# Vivado block design design_1, xczu28dr-ffvg1517-2-e, Vivado 2019.1
# (continued, part 2 of 3)
current_bd_instance /tx_datapath/macro_channel_1/soft_reset

# ---- hierarchy /tx_datapath/macro_channel_2 ----
current_bd_instance /tx_datapath/macro_channel_2
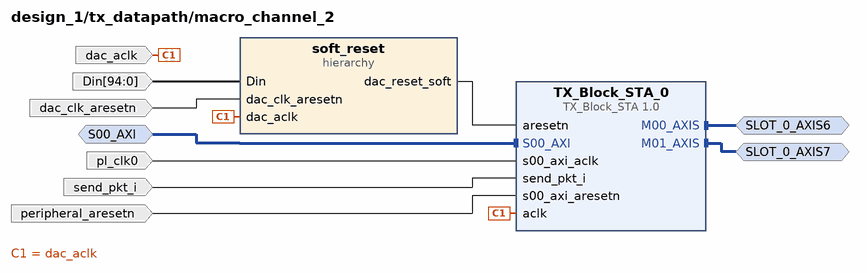
[diagram p19: block diagram inside /tx_datapath/macro_channel_2]
create_bd_intf_pin -mode Master -vlnv xilinx.com:interface:axis_rtl:1.0 SLOT_0_AXIS7
create_bd_intf_pin -mode Master -vlnv xilinx.com:interface:axis_rtl:1.0 SLOT_0_AXIS6
create_bd_intf_pin -mode Slave -vlnv xilinx.com:interface:aximm_rtl:1.0 S00_AXI
create_bd_pin -dir I -from 94 -to 0 Din
create_bd_pin -dir I send_pkt_i
create_bd_pin -dir I -type clk pl_clk0
create_bd_pin -dir I -type rst peripheral_aresetn
create_bd_pin -dir I -type clk dac_clk_aresetn
create_bd_pin -dir I -type clk dac_aclk

create_bd_cell -type hier soft_reset
create_bd_cell -type ip -vlnv user.org:user:TX_Block_STA:1.0 TX_Block_STA_0
set_property -dict {CONFIG.STREAM 2} [get_bd_cells TX_Block_STA_0]

# ---- hierarchy /tx_datapath/macro_channel_2/soft_reset ----
current_bd_instance /tx_datapath/macro_channel_2/soft_reset
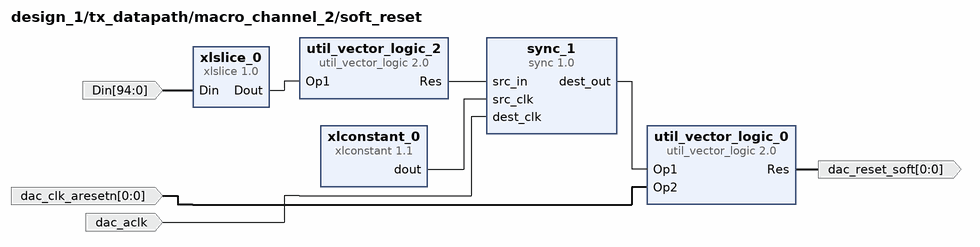
[diagram p20: block diagram inside /tx_datapath/macro_channel_2/soft_reset]
create_bd_pin -dir I -from 0 -to 0 dac_clk_aresetn
create_bd_pin -dir O -from 0 -to 0 dac_reset_soft
create_bd_pin -dir I -type clk dac_aclk
create_bd_pin -dir I -from 94 -to 0 Din

create_bd_cell -type ip -vlnv xilinx.com:ip:xlslice:1.0 xlslice_0
set_property -dict {CONFIG.DIN_FROM 2 CONFIG.DIN_TO 2 CONFIG.DIN_WIDTH 95 CONFIG.DOUT_WIDTH 1} [get_bd_cells xlslice_0]
create_bd_cell -type ip -vlnv xilinx.com:ip:util_vector_logic:2.0 util_vector_logic_0
set_property -dict {CONFIG.C_SIZE 1} [get_bd_cells util_vector_logic_0]
create_bd_cell -type ip -vlnv xilinx.com:ip:util_vector_logic:2.0 util_vector_logic_2
set_property -dict {CONFIG.C_OPERATION not CONFIG.C_SIZE 1} [get_bd_cells util_vector_logic_2]
create_bd_cell -type ip -vlnv xilinx.com:user:sync:1.0 sync_1
set_property -dict {CONFIG.SRC_INPUT_REG 0} [get_bd_cells sync_1]
create_bd_cell -type ip -vlnv xilinx.com:ip:xlconstant:1.1 xlconstant_0
set_property -dict {CONFIG.CONST_VAL 0} [get_bd_cells xlconstant_0]

# ---- hierarchy /tx_datapath/macro_channel_3 ----
current_bd_instance /tx_datapath/macro_channel_3
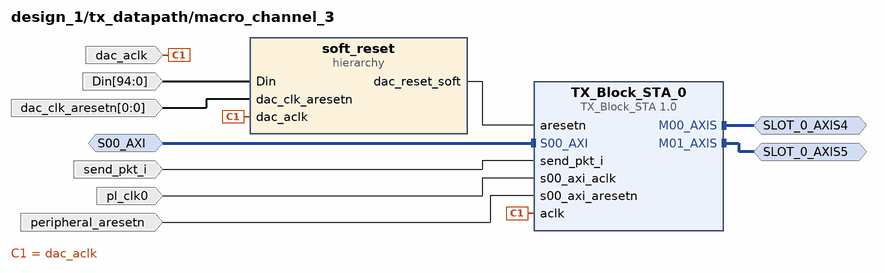
[diagram p21: block diagram inside /tx_datapath/macro_channel_3]
create_bd_intf_pin -mode Master -vlnv xilinx.com:interface:axis_rtl:1.0 SLOT_0_AXIS4
create_bd_intf_pin -mode Master -vlnv xilinx.com:interface:axis_rtl:1.0 SLOT_0_AXIS5
create_bd_intf_pin -mode Slave -vlnv xilinx.com:interface:aximm_rtl:1.0 S00_AXI
create_bd_pin -dir I -from 94 -to 0 Din
create_bd_pin -dir I send_pkt_i
create_bd_pin -dir I -type clk pl_clk0
create_bd_pin -dir I -type rst peripheral_aresetn
create_bd_pin -dir I -type clk dac_aclk
create_bd_pin -dir I -from 0 -to 0 dac_clk_aresetn

create_bd_cell -type hier soft_reset
create_bd_cell -type ip -vlnv user.org:user:TX_Block_STA:1.0 TX_Block_STA_0
set_property -dict {CONFIG.STREAM 3} [get_bd_cells TX_Block_STA_0]

# ---- hierarchy /tx_datapath/macro_channel_3/soft_reset ----
current_bd_instance /tx_datapath/macro_channel_3/soft_reset
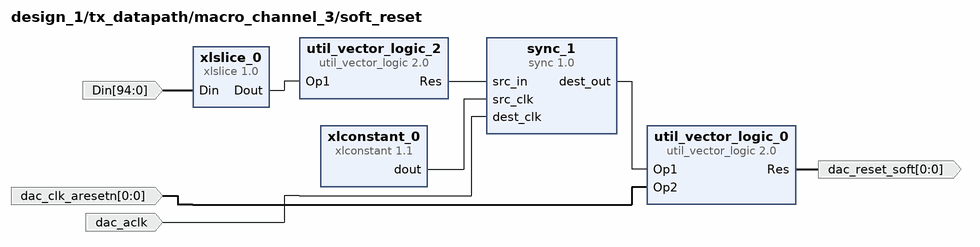
[diagram p22: block diagram inside /tx_datapath/macro_channel_3/soft_reset]
create_bd_pin -dir I -from 0 -to 0 dac_clk_aresetn
create_bd_pin -dir O -from 0 -to 0 dac_reset_soft
create_bd_pin -dir I -type clk dac_aclk
create_bd_pin -dir I -from 94 -to 0 Din

create_bd_cell -type ip -vlnv xilinx.com:ip:xlslice:1.0 xlslice_0
set_property -dict {CONFIG.DIN_FROM 3 CONFIG.DIN_TO 3 CONFIG.DIN_WIDTH 95 CONFIG.DOUT_WIDTH 1} [get_bd_cells xlslice_0]
create_bd_cell -type ip -vlnv xilinx.com:ip:util_vector_logic:2.0 util_vector_logic_0
set_property -dict {CONFIG.C_SIZE 1} [get_bd_cells util_vector_logic_0]
create_bd_cell -type ip -vlnv xilinx.com:ip:util_vector_logic:2.0 util_vector_logic_2
set_property -dict {CONFIG.C_OPERATION not CONFIG.C_SIZE 1} [get_bd_cells util_vector_logic_2]
create_bd_cell -type ip -vlnv xilinx.com:user:sync:1.0 sync_1
set_property -dict {CONFIG.SRC_INPUT_REG 0} [get_bd_cells sync_1]
create_bd_cell -type ip -vlnv xilinx.com:ip:xlconstant:1.1 xlconstant_0
set_property -dict {CONFIG.CONST_VAL 0} [get_bd_cells xlconstant_0]

# ---- connections ----

current_bd_instance /MTS_Block
connect_bd_intf_net [get_bd_intf_pins CLK_DIFF_SYSREF_CLK] [get_bd_intf_pins util_ds_buf_1/CLK_IN_D]
connect_bd_intf_net [get_bd_intf_pins CLK_DIFF_PL_CLK] [get_bd_intf_pins util_ds_buf_0/CLK_IN_D]
connect_bd_net [get_bd_pins util_ds_buf_0/IBUF_OUT] [get_bd_pins clk_wiz_0/clk_in1] [get_bd_pins sync_0/dest_clk]
connect_bd_net [get_bd_pins sync_0/dest_out] [get_bd_pins sync_1/src_in] [get_bd_pins sync_2/src_in]
connect_bd_net [get_bd_pins sync_1/dest_out] [get_bd_pins user_sysref_dac]
connect_bd_net [get_bd_pins xlconstant_0/dout] [get_bd_pins sync_0/src_clk] [get_bd_pins sync_1/src_clk] [get_bd_pins sync_2/src_clk]
connect_bd_net [get_bd_pins util_ds_buf_1/IBUF_OUT] [get_bd_pins sync_0/src_in]
connect_bd_net [get_bd_pins sync_2/dest_out] [get_bd_pins user_sysref_adc]
connect_bd_net [get_bd_pins clk_wiz_0/clk_out3] [get_bd_pins adc45_clk] [get_bd_pins sync_2/dest_clk]
connect_bd_net [get_bd_pins clk_wiz_0/clk_out1] [get_bd_pins dac45_clk] [get_bd_pins sync_1/dest_clk]
connect_bd_net [get_bd_pins clk_wiz_0/clk_out2] [get_bd_pins dac_clk]
connect_bd_net [get_bd_pins clk_wiz_0/clk_out4] [get_bd_pins adc_clk]

current_bd_instance /reset_block
connect_bd_net -net zynq_ultra_ps_e_0_pl_clk0 [get_bd_pins slowest_sync_clk] [get_bd_pins rst_ps8_0_96M/slowest_sync_clk]
connect_bd_net -net zynq_ultra_ps_e_0_pl_resetn0 [get_bd_pins ext_reset_in] \
  [get_bd_pins rst_ps8_0_96M1/ext_reset_in] [get_bd_pins rst_ps8_0_96M/ext_reset_in] \
  [get_bd_pins rst_ps8_0_96M2/ext_reset_in]
connect_bd_net [get_bd_pins rst_ps8_0_96M/peripheral_aresetn] [get_bd_pins peripheral_aresetn]
connect_bd_net -net MTS_Block_dac_clk [get_bd_pins slowest_sync_clk1] [get_bd_pins rst_ps8_0_96M1/slowest_sync_clk]
connect_bd_net [get_bd_pins rst_ps8_0_96M1/peripheral_aresetn] [get_bd_pins peripheral_aresetn1]
connect_bd_net [get_bd_pins rst_ps8_0_96M2/peripheral_aresetn] [get_bd_pins peripheral_aresetn3]
connect_bd_net -net slowest_sync_clk3_1 [get_bd_pins slowest_sync_clk3] [get_bd_pins rst_ps8_0_96M2/slowest_sync_clk]

current_bd_instance /control_block
connect_bd_net -net Din_0_1 [get_bd_pins Din_0] [get_bd_pins globalstart_gpio_adc/Din] [get_bd_pins globalstart_gpio_dac/Din]
connect_bd_net [get_bd_pins xlconstant_0/dout] [get_bd_pins sync_1/src_clk] [get_bd_pins sync_2/src_clk]
connect_bd_net [get_bd_pins sync_1/dest_out] [get_bd_pins adc_control]
connect_bd_net -net dest_clk_1 [get_bd_pins adc_clk] [get_bd_pins sync_1/dest_clk]
connect_bd_net [get_bd_pins globalstart_gpio_adc/Dout] [get_bd_pins sync_1/src_in]
connect_bd_net [get_bd_pins globalstart_gpio_dac/Dout] [get_bd_pins sync_2/src_in]
connect_bd_net [get_bd_pins dest_clk] [get_bd_pins sync_2/dest_clk]
connect_bd_net [get_bd_pins sync_2/dest_out] [get_bd_pins dac_control]

current_bd_instance /SPB_blocks
connect_bd_intf_net -intf_net S01_AXIS1_1 [get_bd_intf_pins S01_AXIS1] [get_bd_intf_pins stream_0/S01_AXIS1]
connect_bd_intf_net [get_bd_intf_pins S00_AXI7] [get_bd_intf_pins stream_3/S00_AXI1]
connect_bd_intf_net [get_bd_intf_pins S00_AXI10] [get_bd_intf_pins stream_2/S00_AXI1]
connect_bd_intf_net [get_bd_intf_pins S00_AXI1] [get_bd_intf_pins stream_0/S00_AXI1]
connect_bd_intf_net [get_bd_intf_pins S01_AXI] [get_bd_intf_pins stream_0/S01_AXI]
connect_bd_intf_net [get_bd_intf_pins S00_AXI9] [get_bd_intf_pins stream_1/S00_AXI1]
connect_bd_intf_net [get_bd_intf_pins S01_AXI2] [get_bd_intf_pins stream_1/S01_AXI]
connect_bd_intf_net [get_bd_intf_pins S00_AXI4] [get_bd_intf_pins stream_3/S00_AXI2]
connect_bd_intf_net [get_bd_intf_pins S06_AXIS] [get_bd_intf_pins stream_3/S06_AXIS]
connect_bd_intf_net [get_bd_intf_pins S04_AXIS] [get_bd_intf_pins stream_2/S04_AXIS]
connect_bd_intf_net [get_bd_intf_pins S02_AXIS] [get_bd_intf_pins stream_1/S02_AXIS]
connect_bd_intf_net [get_bd_intf_pins S05_AXIS] [get_bd_intf_pins stream_2/S05_AXIS]
connect_bd_intf_net [get_bd_intf_pins S03_AXIS] [get_bd_intf_pins stream_1/S03_AXIS]
connect_bd_intf_net [get_bd_intf_pins S01_AXI1] [get_bd_intf_pins stream_3/S01_AXI]
connect_bd_intf_net [get_bd_intf_pins S00_AXI17] [get_bd_intf_pins stream_0/S00_AXI]
connect_bd_intf_net -intf_net S00_AXI2_1 [get_bd_intf_pins S00_AXI2] [get_bd_intf_pins stream_0/S00_AXI2]
connect_bd_intf_net [get_bd_intf_pins S00_AXI3] [get_bd_intf_pins stream_1/S00_AXI]
connect_bd_intf_net [get_bd_intf_pins S07_AXIS] [get_bd_intf_pins stream_3/S07_AXIS]
connect_bd_intf_net [get_bd_intf_pins S00_AXI6] [get_bd_intf_pins stream_2/S00_AXI]
connect_bd_intf_net [get_bd_intf_pins S00_AXI] [get_bd_intf_pins stream_0/S00_AXI3]
connect_bd_intf_net [get_bd_intf_pins S00_AXIS] [get_bd_intf_pins stream_0/S00_AXIS]
connect_bd_intf_net [get_bd_intf_pins S01_AXI4] [get_bd_intf_pins stream_2/S01_AXI]
connect_bd_net [get_bd_pins aclk] \
  [get_bd_pins stream_0/aclk] [get_bd_pins stream_1/aclk] [get_bd_pins stream_2/aclk] [get_bd_pins stream_3/aclk] \
  [get_bd_pins soft_reset/dac_aclk]
connect_bd_net [get_bd_pins s00_axi_aclk] \
  [get_bd_pins stream_0/s00_axi_aclk] [get_bd_pins stream_1/s00_axi_aclk] [get_bd_pins stream_2/s00_axi_aclk] \
  [get_bd_pins stream_3/s00_axi_aclk]
connect_bd_net [get_bd_pins s00_axi_aresetn] \
  [get_bd_pins stream_0/s00_axi_aresetn] [get_bd_pins stream_1/s00_axi_aresetn] [get_bd_pins stream_2/s00_axi_aresetn] \
  [get_bd_pins stream_3/s00_axi_aresetn]
connect_bd_net [get_bd_pins adc_220_aclk] \
  [get_bd_pins stream_0/adc_220_aclk] [get_bd_pins stream_1/adc_220_aclk] [get_bd_pins stream_2/adc_220_aclk] \
  [get_bd_pins stream_3/adc_220_aclk]
connect_bd_net [get_bd_pins adc_220_aresetn] \
  [get_bd_pins stream_0/adc_220_aresetn] [get_bd_pins stream_1/adc_220_aresetn] [get_bd_pins stream_2/adc_220_aresetn] \
  [get_bd_pins stream_3/adc_220_aresetn]
connect_bd_net [get_bd_pins stream_3/PD_FLAG1] [get_bd_pins PD_and_BD_block/Op8]
connect_bd_net [get_bd_pins stream_2/PD_FLAG] [get_bd_pins PD_and_BD_block/Op6]
connect_bd_net [get_bd_pins soft_reset/dac_reset_soft] \
  [get_bd_pins stream_0/adc_clk_soft_aresetn] [get_bd_pins stream_1/adc_clk_soft_aresetn] \
  [get_bd_pins stream_2/adc_clk_soft_aresetn] [get_bd_pins stream_3/adc_clk_soft_aresetn]
connect_bd_net [get_bd_pins adc_clk_soft_aresetn] [get_bd_pins soft_reset/dac_clk_aresetn]
connect_bd_net [get_bd_pins Din] [get_bd_pins soft_reset/Din]
connect_bd_net [get_bd_pins stream_0/PD_FLAG] [get_bd_pins PD_and_BD_block/Op1]
connect_bd_net [get_bd_pins stream_0/BD_FLAG_O] [get_bd_pins PD_and_BD_block/Op2]
connect_bd_net [get_bd_pins stream_1/PD_FLAG] [get_bd_pins PD_and_BD_block/Op3]
connect_bd_net [get_bd_pins stream_1/BD_FLAG_O] [get_bd_pins PD_and_BD_block/Op4]
connect_bd_net [get_bd_pins stream_2/BD_FLAG_O] [get_bd_pins PD_and_BD_block/Op5]
connect_bd_net [get_bd_pins stream_3/BD_FLAG_O] [get_bd_pins PD_and_BD_block/Op7]
connect_bd_net [get_bd_pins PD_and_BD_block/Res] \
  [get_bd_pins stream_1/PD_FLAG1] [get_bd_pins stream_2/PD_FLAG1] [get_bd_pins stream_3/PD_FLAG] \
  [get_bd_pins stream_0/PD_FLAG1]
connect_bd_net [get_bd_pins PD_and_BD_block/Res1] \
  [get_bd_pins stream_1/BD_FLAG] [get_bd_pins stream_2/BD_FLAG] [get_bd_pins stream_3/BD_FLAG] [get_bd_pins stream_0/BD_FLAG]
connect_bd_net [get_bd_pins stream_0/Res] [get_bd_pins PD_and_BD_block/Op9]
connect_bd_net [get_bd_pins stream_1/captur_ready] [get_bd_pins PD_and_BD_block/Op10]
connect_bd_net [get_bd_pins stream_2/captur_ready] [get_bd_pins PD_and_BD_block/Op11]
connect_bd_net [get_bd_pins stream_3/captur_ready] [get_bd_pins PD_and_BD_block/Op12]
connect_bd_net [get_bd_pins PD_and_BD_block/Res2] [get_bd_pins Res]
connect_bd_net -net Op13_1 [get_bd_pins stream_0/ch_en] [get_bd_pins PD_and_BD_block/Op13]
connect_bd_net -net Op14_1 [get_bd_pins stream_1/ch_en] [get_bd_pins PD_and_BD_block/Op14]
connect_bd_net -net Op15_1 [get_bd_pins stream_2/ch_en] [get_bd_pins PD_and_BD_block/Op15]
connect_bd_net -net Op16_1 [get_bd_pins stream_3/ch_en] [get_bd_pins PD_and_BD_block/Op16]
connect_bd_net [get_bd_pins stream_0/o_INC_BP_0] [get_bd_pins o_INC_BP_0]
connect_bd_net [get_bd_pins stream_0/o_RTN_BP_0] [get_bd_pins o_RTN_BP_0]
connect_bd_net -net s00_axis_tvalid1_1 [get_bd_pins s00_axis_tvalid1] \
  [get_bd_pins stream_0/s00_axis_tvalid1] [get_bd_pins stream_1/s00_axis_tvalid1] [get_bd_pins stream_2/s00_axis_tvalid1] \
  [get_bd_pins stream_3/s00_axis_tvalid1]

current_bd_instance /SPB_blocks/stream_0
connect_bd_intf_net [get_bd_intf_pins S01_AXI] [get_bd_intf_pins RX_Block_STA_v2_0/S01_AXI]
connect_bd_intf_net [get_bd_intf_pins packet_detector_11AD_0/M00_AXIS] [get_bd_intf_pins RX_Block_STA_v2_0/S00_AXIS]
connect_bd_intf_net [get_bd_intf_pins S01_AXIS1] [get_bd_intf_pins packet_detector_11AD_0/S01_AXIS]
connect_bd_intf_net [get_bd_intf_pins S00_AXI] [get_bd_intf_pins RX_Block_STA_v2_0/S00_AXI]
connect_bd_intf_net [get_bd_intf_pins S00_AXI1] [get_bd_intf_pins packet_detector_11AD_0/S00_AXI]
connect_bd_intf_net [get_bd_intf_pins S00_AXIS] [get_bd_intf_pins packet_detector_11AD_0/S00_AXIS]
connect_bd_intf_net [get_bd_intf_pins packet_detector_11AD_0/M01_AXIS] [get_bd_intf_pins RX_Block_STA_v2_0/S01_AXIS]
connect_bd_intf_net [get_bd_intf_pins S00_AXI3] [get_bd_intf_pins SIVERS_gpio_0/S00_AXI]
connect_bd_net [get_bd_pins aclk] \
  [get_bd_pins SIVERS_gpio_0/aclk] [get_bd_pins RX_Block_STA_v2_0/adc_440_aclk] [get_bd_pins packet_detector_11AD_0/aclk]
connect_bd_net [get_bd_pins s00_axi_aclk] \
  [get_bd_pins SIVERS_gpio_0/s00_axi_aclk] [get_bd_pins RX_Block_STA_v2_0/s00_axi_aclk] \
  [get_bd_pins packet_detector_11AD_0/s00_axi_aclk]
connect_bd_net [get_bd_pins s00_axi_aresetn] \
  [get_bd_pins SIVERS_gpio_0/s00_axi_aresetn] [get_bd_pins RX_Block_STA_v2_0/s00_axi_aresetn] \
  [get_bd_pins packet_detector_11AD_0/s00_axi_aresetn]
connect_bd_net [get_bd_pins adc_clk_soft_aresetn] \
  [get_bd_pins SIVERS_gpio_0/aresetn] [get_bd_pins RX_Block_STA_v2_0/adc_440_aresetn] \
  [get_bd_pins packet_detector_11AD_0/aresetn]
connect_bd_net [get_bd_pins packet_detector_11AD_0/PD_FLAG] [get_bd_pins PD_FLAG]
connect_bd_net [get_bd_pins RX_Block_STA_v2_0/BD_FLAG_O] [get_bd_pins BD_FLAG_O]
connect_bd_net [get_bd_pins adc_220_aclk] [get_bd_pins RX_Block_STA_v2_0/adc_220_aclk]
connect_bd_net [get_bd_pins adc_220_aresetn] [get_bd_pins RX_Block_STA_v2_0/adc_220_aresetn]
connect_bd_net [get_bd_pins RX_Block_STA_v2_0/captur_ready] [get_bd_pins Res]
connect_bd_net -net PD_FLAG1_1 [get_bd_pins PD_FLAG1] [get_bd_pins RX_Block_STA_v2_0/PD_FLAG]
connect_bd_net [get_bd_pins BD_FLAG] [get_bd_pins SIVERS_gpio_0/i_TRIGGER] [get_bd_pins RX_Block_STA_v2_0/BD_FLAG]
connect_bd_net [get_bd_pins RX_Block_STA_v2_0/ch_en] [get_bd_pins ch_en]
connect_bd_net [get_bd_pins SIVERS_gpio_0/o_INC_BP] [get_bd_pins o_INC_BP_0]
connect_bd_net [get_bd_pins SIVERS_gpio_0/o_RTN_BP] [get_bd_pins o_RTN_BP_0]
connect_bd_net -net s00_axis_tvalid1_1 [get_bd_pins s00_axis_tvalid1] \
  [get_bd_pins packet_detector_11AD_0/s01_axis_tvalid] [get_bd_pins packet_detector_11AD_0/s00_axis_tvalid]

current_bd_instance /SPB_blocks/stream_1
connect_bd_intf_net [get_bd_intf_pins S01_AXI] [get_bd_intf_pins RX_Block_STA_v2_0/S01_AXI]
connect_bd_intf_net [get_bd_intf_pins RX_Block_STA_v2_0/S00_AXIS] [get_bd_intf_pins packet_detector_11AD_1/M00_AXIS]
connect_bd_intf_net [get_bd_intf_pins S00_AXI1] [get_bd_intf_pins RX_Block_STA_v2_0/S00_AXI]
connect_bd_intf_net [get_bd_intf_pins S02_AXIS] [get_bd_intf_pins packet_detector_11AD_1/S00_AXIS]
connect_bd_intf_net [get_bd_intf_pins S00_AXI] [get_bd_intf_pins packet_detector_11AD_1/S00_AXI]
connect_bd_intf_net [get_bd_intf_pins S03_AXIS] [get_bd_intf_pins packet_detector_11AD_1/S01_AXIS]
connect_bd_intf_net [get_bd_intf_pins RX_Block_STA_v2_0/S01_AXIS] [get_bd_intf_pins packet_detector_11AD_1/M01_AXIS]
connect_bd_net [get_bd_pins aclk] [get_bd_pins RX_Block_STA_v2_0/adc_440_aclk] [get_bd_pins packet_detector_11AD_1/aclk]
connect_bd_net [get_bd_pins s00_axi_aclk] [get_bd_pins RX_Block_STA_v2_0/s00_axi_aclk] [get_bd_pins packet_detector_11AD_1/s00_axi_aclk]
connect_bd_net [get_bd_pins s00_axi_aresetn] [get_bd_pins RX_Block_STA_v2_0/s00_axi_aresetn] [get_bd_pins packet_detector_11AD_1/s00_axi_aresetn]
connect_bd_net [get_bd_pins adc_clk_soft_aresetn] [get_bd_pins RX_Block_STA_v2_0/adc_440_aresetn] [get_bd_pins packet_detector_11AD_1/aresetn]
connect_bd_net [get_bd_pins packet_detector_11AD_1/PD_FLAG] [get_bd_pins PD_FLAG]
connect_bd_net [get_bd_pins RX_Block_STA_v2_0/BD_FLAG_O] [get_bd_pins BD_FLAG_O]
connect_bd_net -net PD_FLAG1_1 [get_bd_pins PD_FLAG1] [get_bd_pins RX_Block_STA_v2_0/PD_FLAG]
connect_bd_net [get_bd_pins BD_FLAG] [get_bd_pins RX_Block_STA_v2_0/BD_FLAG]
connect_bd_net [get_bd_pins adc_220_aclk] [get_bd_pins RX_Block_STA_v2_0/adc_220_aclk]
connect_bd_net [get_bd_pins adc_220_aresetn] [get_bd_pins RX_Block_STA_v2_0/adc_220_aresetn]
connect_bd_net [get_bd_pins RX_Block_STA_v2_0/captur_ready] [get_bd_pins captur_ready]
connect_bd_net [get_bd_pins RX_Block_STA_v2_0/ch_en] [get_bd_pins ch_en]
connect_bd_net -net s00_axis_tvalid1_1 [get_bd_pins s00_axis_tvalid1] \
  [get_bd_pins packet_detector_11AD_1/s01_axis_tvalid] [get_bd_pins packet_detector_11AD_1/s00_axis_tvalid]

current_bd_instance /SPB_blocks/stream_2
connect_bd_intf_net [get_bd_intf_pins RX_Block_STA_v2_0/S01_AXIS] [get_bd_intf_pins packet_detector_11AD_2/M01_AXIS]
connect_bd_intf_net [get_bd_intf_pins S04_AXIS] [get_bd_intf_pins packet_detector_11AD_2/S00_AXIS]
connect_bd_intf_net [get_bd_intf_pins RX_Block_STA_v2_0/S00_AXIS] [get_bd_intf_pins packet_detector_11AD_2/M00_AXIS]
connect_bd_intf_net [get_bd_intf_pins S00_AXI] [get_bd_intf_pins packet_detector_11AD_2/S00_AXI]
connect_bd_intf_net [get_bd_intf_pins S05_AXIS] [get_bd_intf_pins packet_detector_11AD_2/S01_AXIS]
connect_bd_intf_net [get_bd_intf_pins S00_AXI1] [get_bd_intf_pins RX_Block_STA_v2_0/S00_AXI]
connect_bd_intf_net [get_bd_intf_pins S01_AXI] [get_bd_intf_pins RX_Block_STA_v2_0/S01_AXI]
connect_bd_net [get_bd_pins aclk] [get_bd_pins RX_Block_STA_v2_0/adc_440_aclk] [get_bd_pins packet_detector_11AD_2/aclk]
connect_bd_net [get_bd_pins s00_axi_aclk] [get_bd_pins RX_Block_STA_v2_0/s00_axi_aclk] [get_bd_pins packet_detector_11AD_2/s00_axi_aclk]
connect_bd_net [get_bd_pins s00_axi_aresetn] [get_bd_pins RX_Block_STA_v2_0/s00_axi_aresetn] [get_bd_pins packet_detector_11AD_2/s00_axi_aresetn]
connect_bd_net [get_bd_pins packet_detector_11AD_2/PD_FLAG] [get_bd_pins PD_FLAG]
connect_bd_net [get_bd_pins adc_clk_soft_aresetn] [get_bd_pins RX_Block_STA_v2_0/adc_440_aresetn] [get_bd_pins packet_detector_11AD_2/aresetn]
connect_bd_net [get_bd_pins RX_Block_STA_v2_0/BD_FLAG_O] [get_bd_pins BD_FLAG_O]
connect_bd_net -net PD_FLAG1_1 [get_bd_pins PD_FLAG1] [get_bd_pins RX_Block_STA_v2_0/PD_FLAG]
connect_bd_net [get_bd_pins BD_FLAG] [get_bd_pins RX_Block_STA_v2_0/BD_FLAG]
connect_bd_net [get_bd_pins adc_220_aclk] [get_bd_pins RX_Block_STA_v2_0/adc_220_aclk]
connect_bd_net [get_bd_pins adc_220_aresetn] [get_bd_pins RX_Block_STA_v2_0/adc_220_aresetn]
connect_bd_net [get_bd_pins RX_Block_STA_v2_0/captur_ready] [get_bd_pins captur_ready]
connect_bd_net [get_bd_pins RX_Block_STA_v2_0/ch_en] [get_bd_pins ch_en]
connect_bd_net -net s00_axis_tvalid1_1 [get_bd_pins s00_axis_tvalid1] \
  [get_bd_pins packet_detector_11AD_2/s01_axis_tvalid] [get_bd_pins packet_detector_11AD_2/s00_axis_tvalid]

current_bd_instance /SPB_blocks/stream_3
connect_bd_intf_net [get_bd_intf_pins RX_Block_STA_v2_0/S00_AXIS] [get_bd_intf_pins packet_detector_11AD_3/M00_AXIS]
connect_bd_intf_net [get_bd_intf_pins RX_Block_STA_v2_0/S01_AXIS] [get_bd_intf_pins packet_detector_11AD_3/M01_AXIS]
connect_bd_intf_net [get_bd_intf_pins S00_AXI2] [get_bd_intf_pins RX_Block_STA_v2_0/S00_AXI]
connect_bd_intf_net [get_bd_intf_pins S07_AXIS] [get_bd_intf_pins packet_detector_11AD_3/S01_AXIS]
connect_bd_intf_net [get_bd_intf_pins S06_AXIS] [get_bd_intf_pins packet_detector_11AD_3/S00_AXIS]
connect_bd_intf_net [get_bd_intf_pins S00_AXI1] [get_bd_intf_pins packet_detector_11AD_3/S00_AXI]
connect_bd_intf_net [get_bd_intf_pins S01_AXI] [get_bd_intf_pins RX_Block_STA_v2_0/S01_AXI]
connect_bd_net [get_bd_pins aclk] [get_bd_pins RX_Block_STA_v2_0/adc_440_aclk] [get_bd_pins packet_detector_11AD_3/aclk]
connect_bd_net [get_bd_pins s00_axi_aclk] [get_bd_pins RX_Block_STA_v2_0/s00_axi_aclk] [get_bd_pins packet_detector_11AD_3/s00_axi_aclk]
connect_bd_net [get_bd_pins s00_axi_aresetn] [get_bd_pins RX_Block_STA_v2_0/s00_axi_aresetn] [get_bd_pins packet_detector_11AD_3/s00_axi_aresetn]
connect_bd_net [get_bd_pins adc_clk_soft_aresetn] [get_bd_pins RX_Block_STA_v2_0/adc_440_aresetn] [get_bd_pins packet_detector_11AD_3/aresetn]
connect_bd_net [get_bd_pins packet_detector_11AD_3/PD_FLAG] [get_bd_pins PD_FLAG1]
connect_bd_net [get_bd_pins RX_Block_STA_v2_0/BD_FLAG_O] [get_bd_pins BD_FLAG_O]
connect_bd_net [get_bd_pins PD_FLAG] [get_bd_pins RX_Block_STA_v2_0/PD_FLAG]
connect_bd_net [get_bd_pins BD_FLAG] [get_bd_pins RX_Block_STA_v2_0/BD_FLAG]
connect_bd_net [get_bd_pins adc_220_aclk] [get_bd_pins RX_Block_STA_v2_0/adc_220_aclk]
connect_bd_net [get_bd_pins adc_220_aresetn] [get_bd_pins RX_Block_STA_v2_0/adc_220_aresetn]
connect_bd_net [get_bd_pins RX_Block_STA_v2_0/captur_ready] [get_bd_pins captur_ready]
connect_bd_net [get_bd_pins RX_Block_STA_v2_0/ch_en] [get_bd_pins ch_en]
connect_bd_net -net s00_axis_tvalid1_1 [get_bd_pins s00_axis_tvalid1] \
  [get_bd_pins packet_detector_11AD_3/s01_axis_tvalid] [get_bd_pins packet_detector_11AD_3/s00_axis_tvalid]

current_bd_instance /SPB_blocks/soft_reset
connect_bd_net [get_bd_pins xlslice_0/Dout] [get_bd_pins util_vector_logic_2/Op1]
connect_bd_net [get_bd_pins util_vector_logic_2/Res] [get_bd_pins sync_1/src_in]
connect_bd_net [get_bd_pins sync_1/dest_out] [get_bd_pins util_vector_logic_0/Op1]
connect_bd_net [get_bd_pins xlconstant_0/dout] [get_bd_pins sync_1/src_clk]
connect_bd_net [get_bd_pins dac_clk_aresetn] [get_bd_pins util_vector_logic_0/Op2]
connect_bd_net [get_bd_pins util_vector_logic_0/Res] [get_bd_pins dac_reset_soft]
connect_bd_net [get_bd_pins dac_aclk] [get_bd_pins sync_1/dest_clk]
connect_bd_net [get_bd_pins Din] [get_bd_pins xlslice_0/Din]

current_bd_instance /SPB_blocks/PD_and_BD_block
connect_bd_net [get_bd_pins PD_FLAG/Res] [get_bd_pins Res]
connect_bd_net -net Op3_1 [get_bd_pins Op3] [get_bd_pins PD_FLAG/Op3]
connect_bd_net -net Op1_1 [get_bd_pins Op1] [get_bd_pins PD_FLAG/Op1]
connect_bd_net -net Op8_1 [get_bd_pins Op8] [get_bd_pins PD_FLAG/Op8]
connect_bd_net -net Op6_1 [get_bd_pins Op6] [get_bd_pins PD_FLAG/Op6]
connect_bd_net -net Op7_1 [get_bd_pins Op7] [get_bd_pins BD_FLAG/Op7]
connect_bd_net -net Op5_1 [get_bd_pins Op5] [get_bd_pins BD_FLAG/Op5]
connect_bd_net -net Op2_1 [get_bd_pins Op2] [get_bd_pins BD_FLAG/Op2]
connect_bd_net -net Op4_1 [get_bd_pins Op4] [get_bd_pins BD_FLAG/Op4]
connect_bd_net [get_bd_pins BD_FLAG/Res1] [get_bd_pins Res1]
connect_bd_net -net Op9_1 [get_bd_pins Op9] [get_bd_pins CAPTURE_READY/Op9]
connect_bd_net -net Op10_1 [get_bd_pins Op10] [get_bd_pins CAPTURE_READY/Op10]
connect_bd_net -net Op11_1 [get_bd_pins Op11] [get_bd_pins CAPTURE_READY/Op11]
connect_bd_net -net Op12_1 [get_bd_pins Op12] [get_bd_pins CAPTURE_READY/Op12]
connect_bd_net [get_bd_pins CAPTURE_READY/Res] [get_bd_pins Res2]
connect_bd_net -net Op13_1 [get_bd_pins Op13] [get_bd_pins BD_FLAG/Op13] [get_bd_pins PD_FLAG/ch_en] [get_bd_pins CAPTURE_READY/ch_en]
connect_bd_net -net Op14_1 [get_bd_pins Op14] [get_bd_pins BD_FLAG/Op14] [get_bd_pins PD_FLAG/ch_en1] [get_bd_pins CAPTURE_READY/ch_en1]
connect_bd_net -net Op15_1 [get_bd_pins Op15] [get_bd_pins BD_FLAG/Op15] [get_bd_pins PD_FLAG/ch_en2] [get_bd_pins CAPTURE_READY/ch_en2]
connect_bd_net -net Op16_1 [get_bd_pins Op16] [get_bd_pins BD_FLAG/Op16] [get_bd_pins PD_FLAG/ch_en3] [get_bd_pins CAPTURE_READY/ch_en3]

current_bd_instance /SPB_blocks/PD_and_BD_block/PD_FLAG
connect_bd_net [get_bd_pins util_vector_logic_2/Res] [get_bd_pins Res]
connect_bd_net [get_bd_pins util_vector_logic_0/Res] [get_bd_pins util_vector_logic_2/Op1]
connect_bd_net [get_bd_pins util_vector_logic_1/Res] [get_bd_pins util_vector_logic_2/Op2]
connect_bd_net -net Op1_1 [get_bd_pins Op1] [get_bd_pins util_vector_logic_3/Op1]
connect_bd_net [get_bd_pins util_vector_logic_3/Res] [get_bd_pins util_vector_logic_0/Op1]
connect_bd_net [get_bd_pins ch_en] [get_bd_pins util_vector_logic_3/Op2]
connect_bd_net -net Op3_1 [get_bd_pins Op3] [get_bd_pins util_vector_logic_4/Op1]
connect_bd_net -net ch_en1_1 [get_bd_pins ch_en1] [get_bd_pins util_vector_logic_4/Op2]
connect_bd_net [get_bd_pins util_vector_logic_4/Res] [get_bd_pins util_vector_logic_0/Op2]
connect_bd_net -net Op6_1 [get_bd_pins Op6] [get_bd_pins util_vector_logic_6/Op1]
connect_bd_net [get_bd_pins util_vector_logic_6/Res] [get_bd_pins util_vector_logic_1/Op1]
connect_bd_net -net ch_en2_1 [get_bd_pins ch_en2] [get_bd_pins util_vector_logic_6/Op2]
connect_bd_net -net Op8_1 [get_bd_pins Op8] [get_bd_pins util_vector_logic_5/Op1]
connect_bd_net -net ch_en3_1 [get_bd_pins ch_en3] [get_bd_pins util_vector_logic_5/Op2]
connect_bd_net [get_bd_pins util_vector_logic_5/Res] [get_bd_pins util_vector_logic_1/Op2]

current_bd_instance /SPB_blocks/PD_and_BD_block/BD_FLAG
connect_bd_net [get_bd_pins util_vector_logic_4/Res] [get_bd_pins util_vector_logic_5/Op2]
connect_bd_net [get_bd_pins util_vector_logic_3/Res] [get_bd_pins util_vector_logic_5/Op1]
connect_bd_net [get_bd_pins util_vector_logic_5/Res] [get_bd_pins Res1]
connect_bd_net -net Op2_1 [get_bd_pins Op2] [get_bd_pins util_vector_logic_0/Op1]
connect_bd_net [get_bd_pins util_vector_logic_0/Res] [get_bd_pins util_vector_logic_3/Op1]
connect_bd_net -net Op13_1 [get_bd_pins Op13] [get_bd_pins util_vector_logic_0/Op2]
connect_bd_net -net Op4_1 [get_bd_pins Op4] [get_bd_pins util_vector_logic_2/Op1]
connect_bd_net [get_bd_pins util_vector_logic_2/Res] [get_bd_pins util_vector_logic_3/Op2]
connect_bd_net -net Op14_1 [get_bd_pins Op14] [get_bd_pins util_vector_logic_2/Op2]
connect_bd_net -net Op5_1 [get_bd_pins Op5] [get_bd_pins util_vector_logic_1/Op1]
connect_bd_net [get_bd_pins util_vector_logic_1/Res] [get_bd_pins util_vector_logic_4/Op1]
connect_bd_net -net Op15_1 [get_bd_pins Op15] [get_bd_pins util_vector_logic_1/Op2]
connect_bd_net -net Op7_1 [get_bd_pins Op7] [get_bd_pins util_vector_logic_6/Op1]
connect_bd_net [get_bd_pins util_vector_logic_6/Res] [get_bd_pins util_vector_logic_4/Op2]
connect_bd_net -net Op16_1 [get_bd_pins Op16] [get_bd_pins util_vector_logic_6/Op2]

current_bd_instance /SPB_blocks/PD_and_BD_block/CAPTURE_READY
connect_bd_net [get_bd_pins util_vector_logic_7/Res] [get_bd_pins util_vector_logic_8/Op2]
connect_bd_net [get_bd_pins util_vector_logic_8/Res] [get_bd_pins Res]
connect_bd_net [get_bd_pins util_vector_logic_6/Res] [get_bd_pins util_vector_logic_8/Op1]
connect_bd_net -net Op9_1 [get_bd_pins Op9] [get_bd_pins util_vector_logic_9/Op1]
connect_bd_net [get_bd_pins util_vector_logic_9/Res] [get_bd_pins util_vector_logic_6/Op1]
connect_bd_net -net Op10_1 [get_bd_pins Op10] [get_bd_pins util_vector_logic_10/Op1]
connect_bd_net [get_bd_pins util_vector_logic_10/Res] [get_bd_pins util_vector_logic_6/Op2]
connect_bd_net -net Op11_1 [get_bd_pins Op11] [get_bd_pins util_vector_logic_11/Op1]
connect_bd_net [get_bd_pins util_vector_logic_11/Res] [get_bd_pins util_vector_logic_7/Op1]
connect_bd_net -net Op12_1 [get_bd_pins Op12] [get_bd_pins util_vector_logic_12/Op1]
connect_bd_net [get_bd_pins util_vector_logic_12/Res] [get_bd_pins util_vector_logic_7/Op2]
connect_bd_net [get_bd_pins ch_en] [get_bd_pins util_vector_logic_9/Op2]
connect_bd_net -net ch_en1_1 [get_bd_pins ch_en1] [get_bd_pins util_vector_logic_10/Op2]
connect_bd_net -net ch_en2_1 [get_bd_pins ch_en2] [get_bd_pins util_vector_logic_11/Op2]
connect_bd_net -net ch_en3_1 [get_bd_pins ch_en3] [get_bd_pins util_vector_logic_12/Op2]

current_bd_instance /tx_datapath
connect_bd_intf_net [get_bd_intf_pins SLOT_0_AXIS5] [get_bd_intf_pins macro_channel_3/SLOT_0_AXIS5]
connect_bd_intf_net [get_bd_intf_pins S00_AXI2] [get_bd_intf_pins macro_channel_1/S00_AXI]
connect_bd_intf_net [get_bd_intf_pins S00_AXI] [get_bd_intf_pins macro_channel_0/S00_AXI]
connect_bd_intf_net [get_bd_intf_pins SLOT_0_AXIS] [get_bd_intf_pins macro_channel_0/SLOT_0_AXIS]
connect_bd_intf_net [get_bd_intf_pins SLOT_0_AXIS6] [get_bd_intf_pins macro_channel_2/SLOT_0_AXIS6]
connect_bd_intf_net [get_bd_intf_pins S00_AXI3] [get_bd_intf_pins macro_channel_2/S00_AXI]
connect_bd_intf_net [get_bd_intf_pins SLOT_0_AXIS7] [get_bd_intf_pins macro_channel_2/SLOT_0_AXIS7]
connect_bd_intf_net [get_bd_intf_pins SLOT_0_AXIS1] [get_bd_intf_pins macro_channel_0/SLOT_0_AXIS1]
connect_bd_intf_net [get_bd_intf_pins SLOT_0_AXIS2] [get_bd_intf_pins macro_channel_1/SLOT_0_AXIS2]
connect_bd_intf_net [get_bd_intf_pins SLOT_0_AXIS4] [get_bd_intf_pins macro_channel_3/SLOT_0_AXIS4]
connect_bd_intf_net [get_bd_intf_pins SLOT_0_AXIS3] [get_bd_intf_pins macro_channel_1/SLOT_0_AXIS3]
connect_bd_intf_net [get_bd_intf_pins S00_AXI4] [get_bd_intf_pins macro_channel_3/S00_AXI]
connect_bd_net [get_bd_pins dac_aclk] \
  [get_bd_pins macro_channel_0/dac_aclk] [get_bd_pins macro_channel_3/dac_aclk] [get_bd_pins macro_channel_1/dac_aclk] \
  [get_bd_pins macro_channel_2/dac_aclk]
connect_bd_net [get_bd_pins Din] \
  [get_bd_pins macro_channel_0/Din] [get_bd_pins macro_channel_1/Din] [get_bd_pins macro_channel_2/Din] \
  [get_bd_pins macro_channel_3/Din]
connect_bd_net [get_bd_pins send_pkt_i] \
  [get_bd_pins macro_channel_0/send_pkt_i] [get_bd_pins macro_channel_2/send_pkt_i] [get_bd_pins macro_channel_3/send_pkt_i] \
  [get_bd_pins macro_channel_1/send_pkt_i]
connect_bd_net [get_bd_pins s00_axi_aclk] \
  [get_bd_pins macro_channel_0/s00_axi_aclk] [get_bd_pins macro_channel_1/pl_clk0] [get_bd_pins macro_channel_2/pl_clk0] \
  [get_bd_pins macro_channel_3/pl_clk0]
connect_bd_net [get_bd_pins s00_axi_aresetn] \
  [get_bd_pins macro_channel_0/s00_axi_aresetn] [get_bd_pins macro_channel_1/peripheral_aresetn] \
  [get_bd_pins macro_channel_2/peripheral_aresetn] [get_bd_pins macro_channel_3/peripheral_aresetn]
connect_bd_net [get_bd_pins dac_clk_aresetn] \
  [get_bd_pins macro_channel_0/dac_clk_aresetn] [get_bd_pins macro_channel_3/dac_clk_aresetn] \
  [get_bd_pins macro_channel_1/dac_clk_aresetn] [get_bd_pins macro_channel_2/dac_clk_aresetn]

current_bd_instance /tx_datapath/macro_channel_0
connect_bd_intf_net [get_bd_intf_pins SLOT_0_AXIS1] [get_bd_intf_pins TX_Block_STA_0/M01_AXIS]
connect_bd_intf_net [get_bd_intf_pins S00_AXI] [get_bd_intf_pins TX_Block_STA_0/S00_AXI]
connect_bd_intf_net [get_bd_intf_pins SLOT_0_AXIS] [get_bd_intf_pins TX_Block_STA_0/M00_AXIS]
connect_bd_net [get_bd_pins dac_aclk] [get_bd_pins soft_reset/dac_aclk] [get_bd_pins TX_Block_STA_0/aclk]
connect_bd_net [get_bd_pins Din] [get_bd_pins soft_reset/Din]
connect_bd_net [get_bd_pins s00_axi_aclk] [get_bd_pins TX_Block_STA_0/s00_axi_aclk]
connect_bd_net [get_bd_pins send_pkt_i] [get_bd_pins TX_Block_STA_0/send_pkt_i]
connect_bd_net [get_bd_pins s00_axi_aresetn] [get_bd_pins TX_Block_STA_0/s00_axi_aresetn]
connect_bd_net [get_bd_pins soft_reset/dac_reset_soft] [get_bd_pins TX_Block_STA_0/aresetn]
connect_bd_net [get_bd_pins dac_clk_aresetn] [get_bd_pins soft_reset/dac_clk_aresetn]

current_bd_instance /tx_datapath/macro_channel_0/soft_reset
connect_bd_net [get_bd_pins xlslice_0/Dout] [get_bd_pins util_vector_logic_2/Op1]
connect_bd_net [get_bd_pins util_vector_logic_2/Res] [get_bd_pins sync_1/src_in]
connect_bd_net [get_bd_pins sync_1/dest_out] [get_bd_pins util_vector_logic_0/Op1]
connect_bd_net [get_bd_pins xlconstant_0/dout] [get_bd_pins sync_1/src_clk]
connect_bd_net [get_bd_pins dac_clk_aresetn] [get_bd_pins util_vector_logic_0/Op2]
connect_bd_net [get_bd_pins util_vector_logic_0/Res] [get_bd_pins dac_reset_soft]
connect_bd_net [get_bd_pins dac_aclk] [get_bd_pins sync_1/dest_clk]
connect_bd_net [get_bd_pins Din] [get_bd_pins xlslice_0/Din]

current_bd_instance /tx_datapath/macro_channel_1
connect_bd_intf_net [get_bd_intf_pins S00_AXI] [get_bd_intf_pins TX_Block_STA_0/S00_AXI]
connect_bd_intf_net [get_bd_intf_pins SLOT_0_AXIS2] [get_bd_intf_pins TX_Block_STA_0/M00_AXIS]
connect_bd_intf_net [get_bd_intf_pins SLOT_0_AXIS3] [get_bd_intf_pins TX_Block_STA_0/M01_AXIS]
connect_bd_net [get_bd_pins Din] [get_bd_pins soft_reset/Din]
connect_bd_net -net pl_clk0_1 [get_bd_pins pl_clk0] [get_bd_pins TX_Block_STA_0/s00_axi_aclk]
connect_bd_net [get_bd_pins peripheral_aresetn] [get_bd_pins TX_Block_STA_0/s00_axi_aresetn]
connect_bd_net [get_bd_pins send_pkt_i] [get_bd_pins TX_Block_STA_0/send_pkt_i]
connect_bd_net [get_bd_pins dac_clk_aresetn] [get_bd_pins soft_reset/dac_clk_aresetn]
connect_bd_net [get_bd_pins dac_aclk] [get_bd_pins soft_reset/dac_aclk] [get_bd_pins TX_Block_STA_0/aclk]
connect_bd_net [get_bd_pins soft_reset/dac_reset_soft] [get_bd_pins TX_Block_STA_0/aresetn]

current_bd_instance /tx_datapath/macro_channel_1/soft_reset
connect_bd_net [get_bd_pins xlslice_0/Dout] [get_bd_pins util_vector_logic_2/Op1]
connect_bd_net [get_bd_pins util_vector_logic_2/Res] [get_bd_pins sync_1/src_in]
connect_bd_net [get_bd_pins sync_1/dest_out] [get_bd_pins util_vector_logic_0/Op1]
connect_bd_net [get_bd_pins xlconstant_0/dout] [get_bd_pins sync_1/src_clk]
connect_bd_net [get_bd_pins dac_clk_aresetn] [get_bd_pins util_vector_logic_0/Op2]
connect_bd_net [get_bd_pins util_vector_logic_0/Res] [get_bd_pins dac_reset_soft]
connect_bd_net [get_bd_pins dac_aclk] [get_bd_pins sync_1/dest_clk]
connect_bd_net [get_bd_pins Din] [get_bd_pins xlslice_0/Din]

current_bd_instance /tx_datapath/macro_channel_2
connect_bd_intf_net [get_bd_intf_pins SLOT_0_AXIS7] [get_bd_intf_pins TX_Block_STA_0/M01_AXIS]
connect_bd_intf_net [get_bd_intf_pins S00_AXI] [get_bd_intf_pins TX_Block_STA_0/S00_AXI]
connect_bd_intf_net [get_bd_intf_pins SLOT_0_AXIS6] [get_bd_intf_pins TX_Block_STA_0/M00_AXIS]
connect_bd_net [get_bd_pins Din] [get_bd_pins soft_reset/Din]
connect_bd_net -net pl_clk0_1 [get_bd_pins pl_clk0] [get_bd_pins TX_Block_STA_0/s00_axi_aclk]
connect_bd_net [get_bd_pins send_pkt_i] [get_bd_pins TX_Block_STA_0/send_pkt_i]
connect_bd_net [get_bd_pins peripheral_aresetn] [get_bd_pins TX_Block_STA_0/s00_axi_aresetn]
connect_bd_net [get_bd_pins soft_reset/dac_reset_soft] [get_bd_pins TX_Block_STA_0/aresetn]
connect_bd_net [get_bd_pins dac_clk_aresetn] [get_bd_pins soft_reset/dac_clk_aresetn]
connect_bd_net [get_bd_pins dac_aclk] [get_bd_pins soft_reset/dac_aclk] [get_bd_pins TX_Block_STA_0/aclk]

current_bd_instance /tx_datapath/macro_channel_2/soft_reset
connect_bd_net [get_bd_pins xlslice_0/Dout] [get_bd_pins util_vector_logic_2/Op1]
connect_bd_net [get_bd_pins util_vector_logic_2/Res] [get_bd_pins sync_1/src_in]
connect_bd_net [get_bd_pins sync_1/dest_out] [get_bd_pins util_vector_logic_0/Op1]
connect_bd_net [get_bd_pins xlconstant_0/dout] [get_bd_pins sync_1/src_clk]
connect_bd_net [get_bd_pins dac_clk_aresetn] [get_bd_pins util_vector_logic_0/Op2]
connect_bd_net [get_bd_pins util_vector_logic_0/Res] [get_bd_pins dac_reset_soft]
connect_bd_net [get_bd_pins dac_aclk] [get_bd_pins sync_1/dest_clk]
connect_bd_net [get_bd_pins Din] [get_bd_pins xlslice_0/Din]

current_bd_instance /tx_datapath/macro_channel_3
connect_bd_intf_net [get_bd_intf_pins S00_AXI] [get_bd_intf_pins TX_Block_STA_0/S00_AXI]
connect_bd_intf_net [get_bd_intf_pins SLOT_0_AXIS5] [get_bd_intf_pins TX_Block_STA_0/M01_AXIS]
connect_bd_intf_net [get_bd_intf_pins SLOT_0_AXIS4] [get_bd_intf_pins TX_Block_STA_0/M00_AXIS]
connect_bd_net [get_bd_pins Din] [get_bd_pins soft_reset/Din]
connect_bd_net [get_bd_pins send_pkt_i] [get_bd_pins TX_Block_STA_0/send_pkt_i]
connect_bd_net -net pl_clk0_1 [get_bd_pins pl_clk0] [get_bd_pins TX_Block_STA_0/s00_axi_aclk]
connect_bd_net [get_bd_pins peripheral_aresetn] [get_bd_pins TX_Block_STA_0/s00_axi_aresetn]
connect_bd_net [get_bd_pins dac_aclk] [get_bd_pins soft_reset/dac_aclk] [get_bd_pins TX_Block_STA_0/aclk]
connect_bd_net [get_bd_pins dac_clk_aresetn] [get_bd_pins soft_reset/dac_clk_aresetn]
connect_bd_net [get_bd_pins soft_reset/dac_reset_soft] [get_bd_pins TX_Block_STA_0/aresetn]

current_bd_instance /tx_datapath/macro_channel_3/soft_reset
connect_bd_net [get_bd_pins xlslice_0/Dout] [get_bd_pins util_vector_logic_2/Op1]
connect_bd_net [get_bd_pins util_vector_logic_2/Res] [get_bd_pins sync_1/src_in]
connect_bd_net [get_bd_pins sync_1/dest_out] [get_bd_pins util_vector_logic_0/Op1]
connect_bd_net [get_bd_pins xlconstant_0/dout] [get_bd_pins sync_1/src_clk]
connect_bd_net [get_bd_pins dac_clk_aresetn] [get_bd_pins util_vector_logic_0/Op2]
connect_bd_net [get_bd_pins util_vector_logic_0/Res] [get_bd_pins dac_reset_soft]
connect_bd_net [get_bd_pins dac_aclk] [get_bd_pins sync_1/dest_clk]
connect_bd_net [get_bd_pins Din] [get_bd_pins xlslice_0/Din]

current_bd_instance /
connect_bd_intf_net -intf_net CLK_IN_D_0_1 [get_bd_intf_ports CLK_DIFF_PL_CLK] [get_bd_intf_pins MTS_Block/CLK_DIFF_PL_CLK]
connect_bd_intf_net -intf_net S00_AXI4_2 [get_bd_intf_pins tx_datapath/S00_AXI4] [get_bd_intf_pins axi_interconnect_2/M12_AXI]
connect_bd_intf_net [get_bd_intf_pins axi_interconnect_2/S00_AXI] [get_bd_intf_pins zynq_ultra_ps_e_0/M_AXI_HPM1_FPD]
connect_bd_intf_net -intf_net vin1_23_0_1 [get_bd_intf_ports vin1_23_0] [get_bd_intf_pins usp_rf_data_converter_0/vin1_23]
connect_bd_intf_net -intf_net tx_SLOT_0_AXIS3 [get_bd_intf_pins usp_rf_data_converter_0/s03_axis] [get_bd_intf_pins tx_datapath/SLOT_0_AXIS3]
connect_bd_intf_net [get_bd_intf_pins usp_rf_data_converter_0/s11_axis] [get_bd_intf_pins tx_datapath/SLOT_0_AXIS7]
connect_bd_intf_net [get_bd_intf_pins usp_rf_data_converter_0/s10_axis] [get_bd_intf_pins tx_datapath/SLOT_0_AXIS6]
connect_bd_intf_net -intf_net dac0_clk_0_1 [get_bd_intf_ports dac0_clk] [get_bd_intf_pins usp_rf_data_converter_0/dac0_clk]
connect_bd_intf_net [get_bd_intf_ports vout13_0] [get_bd_intf_pins usp_rf_data_converter_0/vout13]
connect_bd_intf_net -intf_net vin0_01_0_1 [get_bd_intf_ports vin0_01_0] [get_bd_intf_pins usp_rf_data_converter_0/vin0_01]
connect_bd_intf_net -intf_net S00_AXI3_1 [get_bd_intf_pins tx_datapath/S00_AXI3] [get_bd_intf_pins axi_interconnect_2/M13_AXI]
connect_bd_intf_net -intf_net S00_AXI17_1 [get_bd_intf_pins SPB_blocks/S00_AXI17] [get_bd_intf_pins axi_interconnect_2/M02_AXI]
connect_bd_intf_net [get_bd_intf_pins axi_interconnect_2/M08_AXI] [get_bd_intf_pins SPB_blocks/S00_AXI2]
connect_bd_intf_net [get_bd_intf_pins axi_interconnect_2/M09_AXI] [get_bd_intf_pins SPB_blocks/S01_AXI4]
connect_bd_intf_net [get_bd_intf_pins axi_interconnect_2/M06_AXI] [get_bd_intf_pins SPB_blocks/S01_AXI2]
connect_bd_intf_net -intf_net tx_SLOT_0_AXIS1 [get_bd_intf_pins usp_rf_data_converter_0/s01_axis] [get_bd_intf_pins tx_datapath/SLOT_0_AXIS1]
connect_bd_intf_net -intf_net S00_AXI8_1 [get_bd_intf_pins SPB_blocks/S00_AXI8] [get_bd_intf_pins axi_interconnect_2/M11_AXI]
connect_bd_intf_net [get_bd_intf_pins SPB_blocks/S01_AXI] [get_bd_intf_pins axi_interconnect_2/M00_AXI]
connect_bd_intf_net [get_bd_intf_pins axi_interconnect_2/M20_AXI] [get_bd_intf_pins SPB_blocks/S00_AXI6]
connect_bd_intf_net [get_bd_intf_pins usp_rf_data_converter_0/s_axi] [get_bd_intf_pins axi_interconnect_2/M01_AXI]
connect_bd_intf_net [get_bd_intf_ports vout01_0] [get_bd_intf_pins usp_rf_data_converter_0/vout01]
connect_bd_intf_net [get_bd_intf_ports vout10_0] [get_bd_intf_pins usp_rf_data_converter_0/vout10]
connect_bd_intf_net [get_bd_intf_pins usp_rf_data_converter_0/m20_axis] [get_bd_intf_pins SPB_blocks/S04_AXIS]
connect_bd_intf_net [get_bd_intf_pins axi_interconnect_2/M14_AXI] [get_bd_intf_pins SPB_blocks/S00_AXI]
connect_bd_intf_net [get_bd_intf_pins tx_datapath/SLOT_0_AXIS5] [get_bd_intf_pins usp_rf_data_converter_0/s13_axis]
connect_bd_intf_net [get_bd_intf_ports vout11_0] [get_bd_intf_pins usp_rf_data_converter_0/vout11]
connect_bd_intf_net -intf_net vin2_23_0_1 [get_bd_intf_ports vin2_23_0] [get_bd_intf_pins usp_rf_data_converter_0/vin2_23]
connect_bd_intf_net [get_bd_intf_pins axi_interconnect_2/M05_AXI] [get_bd_intf_pins SPB_blocks/S00_AXI9]
connect_bd_intf_net -intf_net vin2_01_0_1 [get_bd_intf_ports vin2_01_0] [get_bd_intf_pins usp_rf_data_converter_0/vin2_01]
connect_bd_intf_net -intf_net adc3_clk_0_1 [get_bd_intf_ports adc3_clk_0] [get_bd_intf_pins usp_rf_data_converter_0/adc3_clk]
connect_bd_intf_net [get_bd_intf_ports CLK_DIFF_SYSREF_CLK] [get_bd_intf_pins MTS_Block/CLK_DIFF_SYSREF_CLK]
connect_bd_intf_net [get_bd_intf_pins usp_rf_data_converter_0/m10_axis] [get_bd_intf_pins SPB_blocks/S02_AXIS]
connect_bd_intf_net [get_bd_intf_pins usp_rf_data_converter_0/m00_axis] [get_bd_intf_pins SPB_blocks/S00_AXIS]
connect_bd_intf_net -intf_net vin3_23_0_1 [get_bd_intf_ports vin3_23_0] [get_bd_intf_pins usp_rf_data_converter_0/vin3_23]
connect_bd_intf_net [get_bd_intf_ports vout03_0] [get_bd_intf_pins usp_rf_data_converter_0/vout03]
connect_bd_intf_net -intf_net tx_SLOT_0_AXIS4 [get_bd_intf_pins usp_rf_data_converter_0/s12_axis] [get_bd_intf_pins tx_datapath/SLOT_0_AXIS4]
connect_bd_intf_net -intf_net tx_SLOT_0_AXIS [get_bd_intf_pins usp_rf_data_converter_0/s00_axis] [get_bd_intf_pins tx_datapath/SLOT_0_AXIS]
connect_bd_intf_net [get_bd_intf_pins axi_interconnect_2/M03_AXI] [get_bd_intf_pins SPB_blocks/S00_AXI4]
connect_bd_intf_net -intf_net vin3_01_0_1 [get_bd_intf_ports vin3_01_0] [get_bd_intf_pins usp_rf_data_converter_0/vin3_01]
connect_bd_intf_net [get_bd_intf_ports vout02_0] [get_bd_intf_pins usp_rf_data_converter_0/vout02]
connect_bd_intf_net -intf_net adc2_clk_0_1 [get_bd_intf_ports adc2_clk_0] [get_bd_intf_pins usp_rf_data_converter_0/adc2_clk]
connect_bd_intf_net -intf_net vin0_23_0_1 [get_bd_intf_ports vin0_23_0] [get_bd_intf_pins usp_rf_data_converter_0/vin0_23]
connect_bd_intf_net [get_bd_intf_pins axi_interconnect_2/M21_AXI] [get_bd_intf_pins SPB_blocks/S00_AXI7]
connect_bd_intf_net -intf_net tx_SLOT_0_AXIS2 [get_bd_intf_pins usp_rf_data_converter_0/s02_axis] [get_bd_intf_pins tx_datapath/SLOT_0_AXIS2]
connect_bd_intf_net -intf_net vin1_01_0_1 [get_bd_intf_ports vin1_01_0] [get_bd_intf_pins usp_rf_data_converter_0/vin1_01]
connect_bd_intf_net -intf_net adc0_clk_0_1 [get_bd_intf_ports adc0_clk_0] [get_bd_intf_pins usp_rf_data_converter_0/adc0_clk]
connect_bd_intf_net [get_bd_intf_pins axi_interconnect_2/M19_AXI] [get_bd_intf_pins SPB_blocks/S00_AXI3]
connect_bd_intf_net -intf_net adc1_clk_0_1 [get_bd_intf_ports adc1_clk_0] [get_bd_intf_pins usp_rf_data_converter_0/adc1_clk]
connect_bd_intf_net [get_bd_intf_ports vout00_0] [get_bd_intf_pins usp_rf_data_converter_0/vout00]
connect_bd_intf_net [get_bd_intf_pins axi_interconnect_2/M18_AXI] [get_bd_intf_pins SPB_blocks/S00_AXI1]
connect_bd_intf_net [get_bd_intf_pins axi_interconnect_2/M16_AXI] [get_bd_intf_pins tx_datapath/S00_AXI]
connect_bd_intf_net [get_bd_intf_pins usp_rf_data_converter_0/m02_axis] [get_bd_intf_pins SPB_blocks/S01_AXIS1]
connect_bd_intf_net -intf_net S00_AXI2_1 [get_bd_intf_pins tx_datapath/S00_AXI2] [get_bd_intf_pins axi_interconnect_2/M17_AXI]
connect_bd_intf_net [get_bd_intf_pins usp_rf_data_converter_0/m12_axis] [get_bd_intf_pins SPB_blocks/S03_AXIS]
connect_bd_intf_net [get_bd_intf_pins usp_rf_data_converter_0/m22_axis] [get_bd_intf_pins SPB_blocks/S05_AXIS]
connect_bd_intf_net [get_bd_intf_ports vout12_0] [get_bd_intf_pins usp_rf_data_converter_0/vout12]
connect_bd_intf_net -intf_net dac1_clk_0_1 [get_bd_intf_ports dac1_clk_0] [get_bd_intf_pins usp_rf_data_converter_0/dac1_clk]
connect_bd_intf_net [get_bd_intf_pins axi_interconnect_2/M07_AXI] [get_bd_intf_pins SPB_blocks/S00_AXI10]
connect_bd_intf_net -intf_net sysref_in_0_1 [get_bd_intf_ports sysref_in] [get_bd_intf_pins usp_rf_data_converter_0/sysref_in]
connect_bd_intf_net [get_bd_intf_pins axi_interconnect_2/M04_AXI] [get_bd_intf_pins SPB_blocks/S01_AXI1]
connect_bd_intf_net [get_bd_intf_pins usp_rf_data_converter_0/m32_axis] [get_bd_intf_pins SPB_blocks/S07_AXIS]
connect_bd_intf_net -intf_net S01_AXI3_1 [get_bd_intf_pins SPB_blocks/S01_AXI3] [get_bd_intf_pins axi_interconnect_2/M10_AXI]
connect_bd_intf_net [get_bd_intf_pins usp_rf_data_converter_0/m30_axis] [get_bd_intf_pins SPB_blocks/S06_AXIS]
connect_bd_net [get_bd_pins zynq_ultra_ps_e_0/pl_resetn0] [get_bd_pins reset_block/ext_reset_in]
connect_bd_net -net rst_ps8_0_96M_peripheral_aresetn [get_bd_pins reset_block/peripheral_aresetn] \
  [get_bd_pins usp_rf_data_converter_0/s_axi_aresetn] [get_bd_pins axi_interconnect_2/ARESETN] \
  [get_bd_pins axi_interconnect_2/S00_ARESETN] [get_bd_pins axi_interconnect_2/M00_ARESETN] \
  [get_bd_pins axi_interconnect_2/M01_ARESETN] [get_bd_pins axi_interconnect_2/M02_ARESETN] \
  [get_bd_pins axi_interconnect_2/M03_ARESETN] [get_bd_pins axi_interconnect_2/M04_ARESETN] \
  [get_bd_pins axi_interconnect_2/M05_ARESETN] [get_bd_pins axi_interconnect_2/M06_ARESETN] \
  [get_bd_pins axi_interconnect_2/M07_ARESETN] [get_bd_pins axi_interconnect_2/M08_ARESETN] \
  [get_bd_pins axi_interconnect_2/M09_ARESETN] [get_bd_pins axi_interconnect_2/M10_ARESETN] \
  [get_bd_pins axi_interconnect_2/M11_ARESETN] [get_bd_pins axi_interconnect_2/M12_ARESETN] \
  [get_bd_pins axi_interconnect_2/M13_ARESETN] [get_bd_pins axi_interconnect_2/M14_ARESETN] \
  [get_bd_pins axi_interconnect_2/M15_ARESETN] [get_bd_pins axi_interconnect_2/M16_ARESETN] \
  [get_bd_pins axi_interconnect_2/M17_ARESETN] [get_bd_pins SPB_blocks/s00_axi_aresetn] \
  [get_bd_pins tx_datapath/s00_axi_aresetn] [get_bd_pins axi_interconnect_2/M18_ARESETN] \
  [get_bd_pins axi_interconnect_2/M19_ARESETN] [get_bd_pins axi_interconnect_2/M20_ARESETN] \
  [get_bd_pins axi_interconnect_2/M21_ARESETN]
connect_bd_net [get_bd_pins reset_block/peripheral_aresetn1] \
  [get_bd_pins usp_rf_data_converter_0/s0_axis_aresetn] [get_bd_pins usp_rf_data_converter_0/s1_axis_aresetn] \
  [get_bd_pins tx_datapath/dac_clk_aresetn] [get_bd_pins SPB_blocks/adc_220_aresetn]
connect_bd_net -net MTS_Block_dac_clk [get_bd_pins MTS_Block/dac45_clk] \
  [get_bd_pins reset_block/slowest_sync_clk1] [get_bd_pins usp_rf_data_converter_0/s0_axis_aclk] \
  [get_bd_pins usp_rf_data_converter_0/s1_axis_aclk] [get_bd_pins tx_datapath/dac_aclk] [get_bd_pins SPB_blocks/adc_220_aclk]
connect_bd_net [get_bd_pins zynq_ultra_ps_e_0/emio_gpio_o] \
  [get_bd_pins control_block/Din_0] [get_bd_pins tx_datapath/Din] [get_bd_pins SPB_blocks/Din]
connect_bd_net [get_bd_pins zynq_ultra_ps_e_0/pl_clk0] \
  [get_bd_pins reset_block/slowest_sync_clk] [get_bd_pins usp_rf_data_converter_0/s_axi_aclk] \
  [get_bd_pins zynq_ultra_ps_e_0/maxihpm1_fpd_aclk] [get_bd_pins axi_interconnect_2/S00_ACLK] \
  [get_bd_pins axi_interconnect_2/M00_ACLK] [get_bd_pins axi_interconnect_2/M01_ACLK] \
  [get_bd_pins axi_interconnect_2/M02_ACLK] [get_bd_pins axi_interconnect_2/M03_ACLK] \
  [get_bd_pins axi_interconnect_2/M04_ACLK] [get_bd_pins axi_interconnect_2/ACLK] [get_bd_pins axi_interconnect_2/M05_ACLK] \
  [get_bd_pins axi_interconnect_2/M06_ACLK] [get_bd_pins axi_interconnect_2/M07_ACLK] \
  [get_bd_pins axi_interconnect_2/M08_ACLK] [get_bd_pins axi_interconnect_2/M09_ACLK] \
  [get_bd_pins axi_interconnect_2/M10_ACLK] [get_bd_pins axi_interconnect_2/M11_ACLK] \
  [get_bd_pins axi_interconnect_2/M12_ACLK] [get_bd_pins axi_interconnect_2/M13_ACLK] \
  [get_bd_pins axi_interconnect_2/M14_ACLK] [get_bd_pins axi_interconnect_2/M15_ACLK] \
  [get_bd_pins axi_interconnect_2/M16_ACLK] [get_bd_pins axi_interconnect_2/M17_ACLK] [get_bd_pins SPB_blocks/s00_axi_aclk] \
  [get_bd_pins tx_datapath/s00_axi_aclk] [get_bd_pins axi_interconnect_2/M18_ACLK] [get_bd_pins axi_interconnect_2/M19_ACLK] \
  [get_bd_pins axi_interconnect_2/M20_ACLK] [get_bd_pins axi_interconnect_2/M21_ACLK]
connect_bd_net -net s_axis_aclk1_1 [get_bd_pins MTS_Block/adc45_clk] \
  [get_bd_pins reset_block/slowest_sync_clk3] [get_bd_pins usp_rf_data_converter_0/m2_axis_aclk] \
  [get_bd_pins usp_rf_data_converter_0/m3_axis_aclk] [get_bd_pins usp_rf_data_converter_0/m0_axis_aclk] \
  [get_bd_pins usp_rf_data_converter_0/m1_axis_aclk] [get_bd_pins SPB_blocks/aclk]
connect_bd_net [get_bd_pins MTS_Block/adc_clk] [get_bd_pins control_block/adc_clk]
connect_bd_net [get_bd_pins reset_block/peripheral_aresetn3] \
  [get_bd_pins usp_rf_data_converter_0/m2_axis_aresetn] [get_bd_pins usp_rf_data_converter_0/m3_axis_aresetn] \
  [get_bd_pins usp_rf_data_converter_0/m1_axis_aresetn] [get_bd_pins usp_rf_data_converter_0/m0_axis_aresetn] \
  [get_bd_pins SPB_blocks/adc_clk_soft_aresetn]
connect_bd_net [get_bd_pins MTS_Block/user_sysref_adc] [get_bd_pins usp_rf_data_converter_0/user_sysref_adc]
connect_bd_net [get_bd_pins MTS_Block/user_sysref_dac] [get_bd_pins usp_rf_data_converter_0/user_sysref_dac]
connect_bd_net [get_bd_pins MTS_Block/dac_clk] [get_bd_pins control_block/dest_clk]
connect_bd_net [get_bd_pins control_block/dac_control] [get_bd_pins tx_datapath/send_pkt_i]
connect_bd_net [get_bd_pins zynq_ultra_ps_e_0/emio_spi0_sclk_o] [get_bd_ports SPI_SCLK]
connect_bd_net [get_bd_pins zynq_ultra_ps_e_0/emio_spi0_m_o] [get_bd_ports SPI_MO]
connect_bd_net [get_bd_pins zynq_ultra_ps_e_0/emio_spi0_ss_o_n] [get_bd_ports SPI_SS0]
connect_bd_net [get_bd_pins zynq_ultra_ps_e_0/emio_spi0_ss1_o_n] [get_bd_ports SPI_SS1]
connect_bd_net [get_bd_pins zynq_ultra_ps_e_0/emio_spi1_sclk_o] [get_bd_ports SPI_SCLK1]
connect_bd_net [get_bd_pins zynq_ultra_ps_e_0/emio_spi1_m_o] [get_bd_ports SPI_MO1]
connect_bd_net [get_bd_pins zynq_ultra_ps_e_0/emio_spi1_ss_o_n] [get_bd_ports SPI_SS2]
connect_bd_net [get_bd_pins zynq_ultra_ps_e_0/emio_spi1_ss1_o_n] [get_bd_ports SPI_SS3]
connect_bd_net [get_bd_pins SPB_blocks/o_INC_BP_0] \
  [get_bd_ports o_INC_BP_0] [get_bd_ports o_INC_BP_3] [get_bd_ports o_INC_BP_2] [get_bd_ports o_INC_BP_1]
connect_bd_net [get_bd_pins SPB_blocks/o_RTN_BP_0] \
  [get_bd_ports o_RTN_BP_0] [get_bd_ports o_RTN_BP_3] [get_bd_ports o_RTN_BP_2] [get_bd_ports o_RTN_BP_1]
connect_bd_net [get_bd_pins SPB_blocks/Res] [get_bd_pins intr_block_0/bd_flag]
connect_bd_net [get_bd_pins intr_block_0/irq] [get_bd_pins zynq_ultra_ps_e_0/pl_ps_irq0]
connect_bd_net [get_bd_pins control_block/adc_control] [get_bd_pins SPB_blocks/s00_axis_tvalid1]
